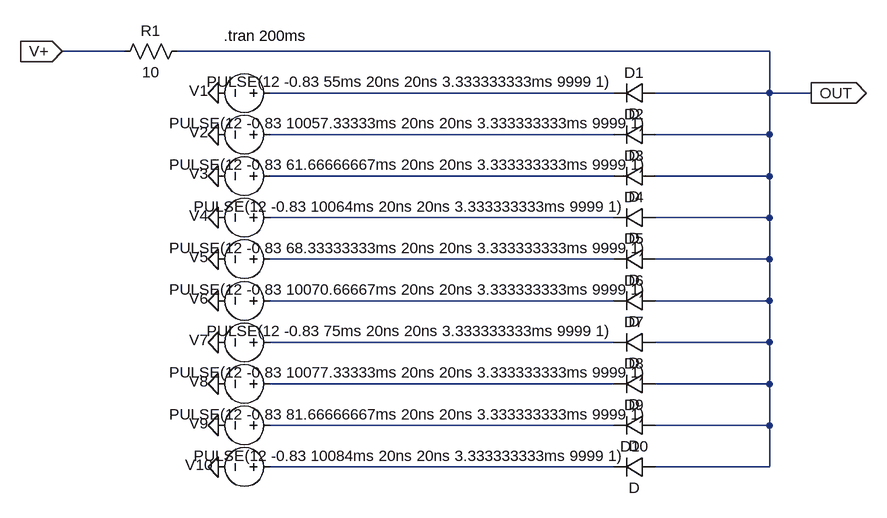
[diagram p0: schematic UARTfaker-2.asc]
UARTfaker-2.asc, the LTspice schematic file:
Version 4
SHEET 1 1560 944
WIRE -304 144 -400 144
WIRE 688 144 -224 144
WIRE 448 208 -80 208
WIRE 688 208 688 144
WIRE 688 208 512 208
WIRE 752 208 688 208
WIRE 448 272 -80 272
WIRE 688 272 688 208
WIRE 688 272 512 272
WIRE 448 336 -80 336
WIRE 688 336 688 272
WIRE 688 336 512 336
WIRE 448 400 -80 400
WIRE 688 400 688 336
WIRE 688 400 512 400
WIRE 448 464 -80 464
WIRE 688 464 688 400
WIRE 688 464 512 464
WIRE 448 528 -80 528
WIRE 688 528 688 464
WIRE 688 528 512 528
WIRE 448 592 -80 592
WIRE 688 592 688 528
WIRE 688 592 512 592
WIRE 448 656 -80 656
WIRE 688 656 688 592
WIRE 688 656 512 656
WIRE 448 720 -80 720
WIRE 688 720 688 656
WIRE 688 720 512 720
WIRE 448 784 -80 784
WIRE 688 784 688 720
WIRE 688 784 512 784
FLAG -160 208 0
FLAG -160 272 0
FLAG -160 336 0
FLAG -160 400 0
FLAG -160 464 0
FLAG -160 528 0
FLAG -160 592 0
FLAG -160 656 0
FLAG -160 720 0
FLAG -160 784 0
FLAG 752 208 OUT
IOPIN 752 208 Out
FLAG -400 144 V+
IOPIN -400 144 In
FLAG -400 144 V+
IOPIN -400 144 In
SYMBOL voltage -64 208 R90
WINDOW 0 12 126 VBottom 2
WINDOW 3 -33 -201 VTop 2
SYMATTR InstName V1
SYMATTR Value PULSE(12 -0.83 55ms 20ns 20ns 3.333333333ms 9999 1)
SYMBOL voltage -64 272 R90
WINDOW 0 12 126 VBottom 2
WINDOW 3 -33 -201 VTop 2
SYMATTR InstName V2
SYMATTR Value PULSE(12 -0.83 10057.33333ms 20ns 20ns 3.333333333ms 9999 1)
SYMBOL voltage -64 336 R90
WINDOW 0 12 126 VBottom 2
WINDOW 3 -33 -201 VTop 2
SYMATTR InstName V3
SYMATTR Value PULSE(12 -0.83 61.66666667ms 20ns 20ns 3.333333333ms 9999 1)
SYMBOL voltage -64 400 R90
WINDOW 0 12 126 VBottom 2
WINDOW 3 -33 -201 VTop 2
SYMATTR InstName V4
SYMATTR Value PULSE(12 -0.83 10064ms 20ns 20ns 3.333333333ms 9999 1)
SYMBOL voltage -64 464 R90
WINDOW 0 12 126 VBottom 2
WINDOW 3 -33 -201 VTop 2
SYMATTR InstName V5
SYMATTR Value PULSE(12 -0.83 68.33333333ms 20ns 20ns 3.333333333ms 9999 1)
SYMBOL voltage -64 528 R90
WINDOW 0 12 126 VBottom 2
WINDOW 3 -33 -201 VTop 2
SYMATTR InstName V6
SYMATTR Value PULSE(12 -0.83 10070.66667ms 20ns 20ns 3.333333333ms 9999 1)
SYMBOL voltage -64 592 R90
WINDOW 0 12 126 VBottom 2
WINDOW 3 -33 -201 VTop 2
SYMATTR InstName V7
SYMATTR Value PULSE(12 -0.83 75ms 20ns 20ns 3.333333333ms 9999 1)
SYMBOL voltage -64 656 R90
WINDOW 0 12 126 VBottom 2
WINDOW 3 -33 -201 VTop 2
SYMATTR InstName V8
SYMATTR Value PULSE(12 -0.83 10077.33333ms 20ns 20ns 3.333333333ms 9999 1)
SYMBOL voltage -64 720 R90
WINDOW 0 12 126 VBottom 2
WINDOW 3 -33 -201 VTop 2
SYMATTR InstName V9
SYMATTR Value PULSE(12 -0.83 81.66666667ms 20ns 20ns 3.333333333ms 9999 1)
SYMBOL voltage -64 784 R90
WINDOW 0 12 126 VBottom 2
WINDOW 3 -33 -201 VTop 2
SYMATTR InstName V10
SYMATTR Value PULSE(12 -0.83 10084ms 20ns 20ns 3.333333333ms 9999 1)
SYMBOL diode 512 192 R90
WINDOW 0 0 32 VBottom 2
WINDOW 3 32 32 VTop 2
SYMATTR InstName D1
SYMBOL diode 512 256 R90
WINDOW 0 0 32 VBottom 2
WINDOW 3 32 32 VTop 2
SYMATTR InstName D2
SYMBOL diode 512 320 R90
WINDOW 0 0 32 VBottom 2
WINDOW 3 32 32 VTop 2
SYMATTR InstName D3
SYMBOL diode 512 384 R90
WINDOW 0 0 32 VBottom 2
WINDOW 3 32 32 VTop 2
SYMATTR InstName D4
SYMBOL diode 512 448 R90
WINDOW 0 0 32 VBottom 2
WINDOW 3 32 32 VTop 2
SYMATTR InstName D5
SYMBOL diode 512 512 R90
WINDOW 0 0 32 VBottom 2
WINDOW 3 32 32 VTop 2
SYMATTR InstName D6
SYMBOL diode 512 576 R90
WINDOW 0 0 32 VBottom 2
WINDOW 3 32 32 VTop 2
SYMATTR InstName D7
SYMBOL diode 512 640 R90
WINDOW 0 0 32 VBottom 2
WINDOW 3 32 32 VTop 2
SYMATTR InstName D8
SYMBOL diode 512 704 R90
WINDOW 0 0 32 VBottom 2
WINDOW 3 32 32 VTop 2
SYMATTR InstName D9
SYMBOL diode 512 768 R90
WINDOW 0 0 32 VBottom 2
WINDOW 3 32 32 VTop 2
SYMATTR InstName D10
SYMBOL res -208 128 R90
WINDOW 0 0 56 VBottom 2
WINDOW 3 32 56 VTop 2
SYMATTR InstName R1
SYMATTR Value 10
TEXT -152 120 Left 2 !.tran 200ms

The netlist it stands for:
* UARTfaker-2.asc
V1 N001 0 PULSE(12 -0.83 55ms 20ns 20ns 3.333333333ms 9999 1)
V2 N002 0 PULSE(12 -0.83 10057.33333ms 20ns 20ns 3.333333333ms 9999 1)
V3 N003 0 PULSE(12 -0.83 61.66666667ms 20ns 20ns 3.333333333ms 9999 1)
V4 N004 0 PULSE(12 -0.83 10064ms 20ns 20ns 3.333333333ms 9999 1)
V5 N005 0 PULSE(12 -0.83 68.33333333ms 20ns 20ns 3.333333333ms 9999 1)
V6 N006 0 PULSE(12 -0.83 10070.66667ms 20ns 20ns 3.333333333ms 9999 1)
V7 N007 0 PULSE(12 -0.83 75ms 20ns 20ns 3.333333333ms 9999 1)
V8 N008 0 PULSE(12 -0.83 10077.33333ms 20ns 20ns 3.333333333ms 9999 1)
V9 N009 0 PULSE(12 -0.83 81.66666667ms 20ns 20ns 3.333333333ms 9999 1)
V10 N010 0 PULSE(12 -0.83 10084ms 20ns 20ns 3.333333333ms 9999 1)
D1 OUT N001 D
D2 OUT N002 D
D3 OUT N003 D
D4 OUT N004 D
D5 OUT N005 D
D6 OUT N006 D
D7 OUT N007 D
D8 OUT N008 D
D9 OUT N009 D
D10 OUT N010 D
R1 OUT V+ 10
.model D D
.lib standard.dio
.tran 200ms
.backanno
.end